# Altium schematic sheet Rs485.SchDoc
size A4
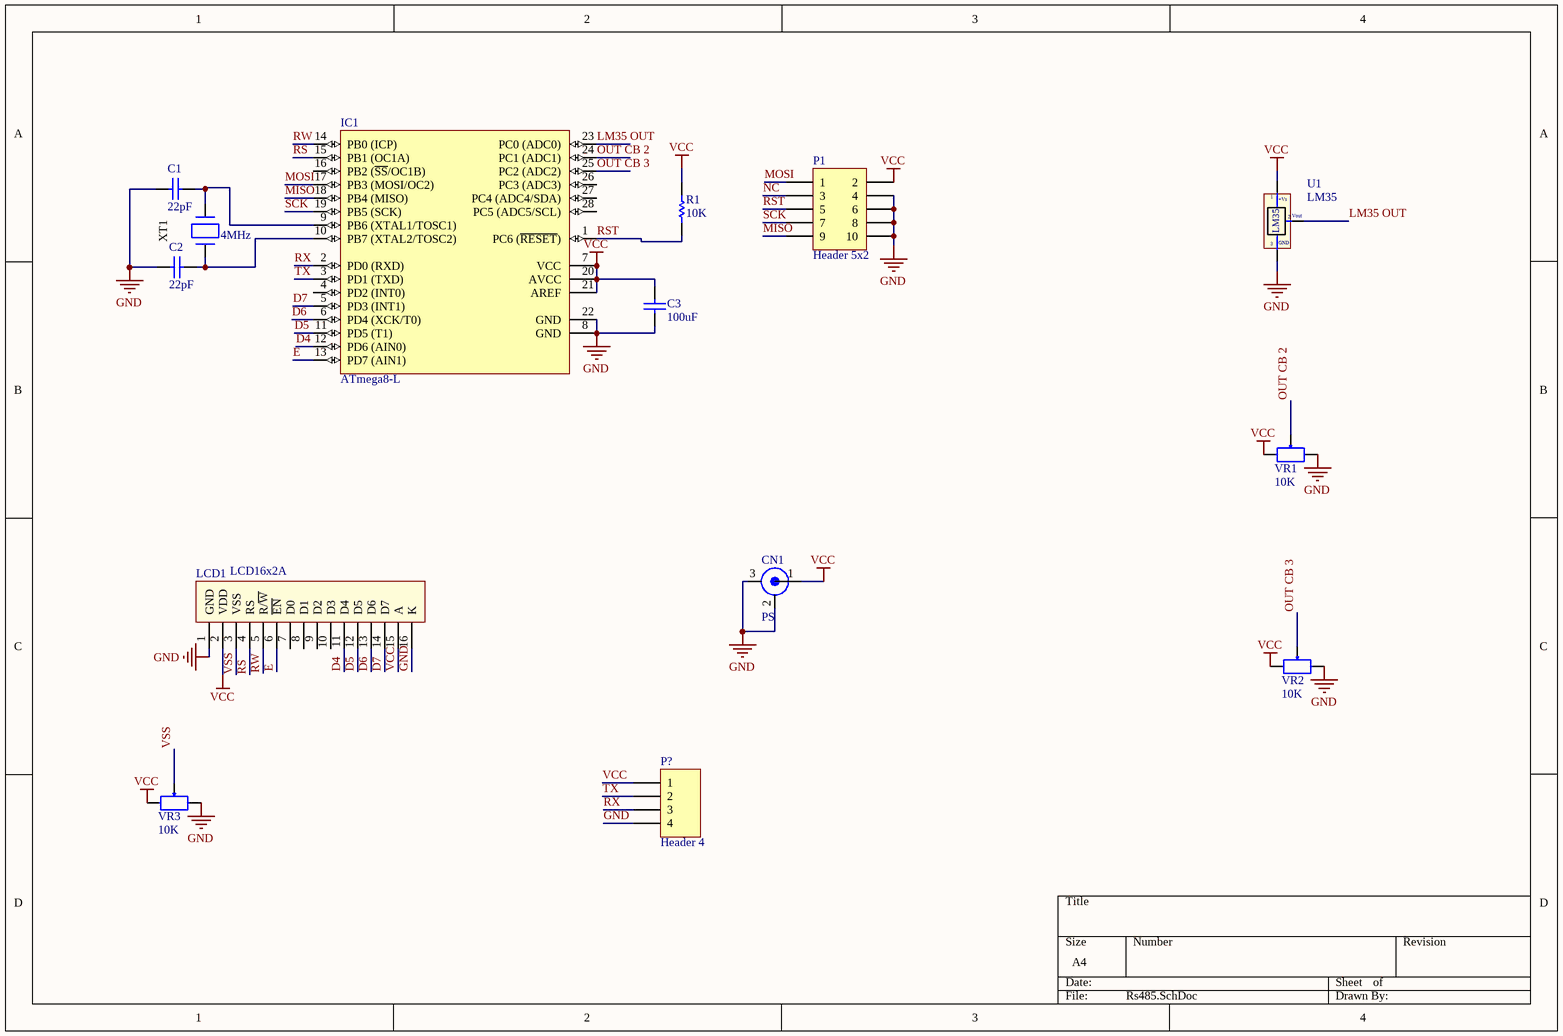
[diagram p0: Rs485.SchDoc]

## Parts
C1  value 22pF  [Cap Non-Pol 3mm]  (hidden comment: Cap Non-pol)
C2  value 22pF  [Cap Non-Pol 3mm]  (hidden comment: Cap Non-pol)
C3  value 100uF  [C-NP-0805]  (hidden comment: Cap Non-pol)
CN1  PS  [DC TERMINAL]
IC1  ATmega8-L  [DIP28/W0.3]
LCD1  LCD16x2A  [LCD16X2]
P1  Header 5x2  [Header 5x2]
P?  Header 4  [Header 4]
R1  value 10K  [R-0805]  (hidden comment: RESISTOR)
U1  LM35  [QTO-92]
VR1  10K  [VR]
VR2  10K  [VR]
VR3  10K  [VR]
XT1  value 4MHz  [Crystal.HC49/USxx]  (hidden comment: Crystal2)

## Nets
GND: C1.2 C2.2 C3.1 CN1.2(SHIELD) CN1.3(SHIELD) IC1.8(GND) IC1.22(GND) LCD1.1(GND) LCD1.16(K) P1.4 P1.6 P1.8 P1.10 P?.4 U1.3(-) VR1.3 VR2.3 VR3.3
VCC: C3.2 CN1.1(CENTER) IC1.7(VCC) IC1.20(AVCC) IC1.21(AREF) LCD1.2(VDD) LCD1.15(A) P1.2 P?.1 R1.2 U1.1(+Vs) VR1.1 VR2.1 VR3.1
D4: IC1.12(PD6_(AIN0)) LCD1.11(D4)
D5: IC1.11(PD5_(T1)) LCD1.12(D5)
D6: IC1.6(PD4_(XCK/T0)) LCD1.13(D6)
D7: IC1.5(PD3_(INT1)) LCD1.14(D7)
E: IC1.13(PD7_(AIN1)) LCD1.6(~{EN})
LM35 OUT: IC1.23(PC0_(ADC0)) U1.2(Vout)
MISO: IC1.18(PB4_(MISO)) P1.9
MOSI: IC1.17(PB3_(MOSI/OC2)) P1.1
NC: P1.3
OUT CB 2: IC1.24(PC1_(ADC1)) VR1.2
OUT CB 3: IC1.25(PC2_(ADC2)) VR2.2
RS: IC1.15(PB1_(OC1A)) LCD1.4(RS)
RST: IC1.1(PC6_(~{RESET})) P1.5 R1.1
RW: IC1.14(PB0_(ICP)) LCD1.5(R/~{W})
RX: IC1.2(PD0_(RXD)) P?.3
SCK: IC1.19(PB5_(SCK)) P1.7
TX: IC1.3(PD1_(TXD)) P?.2
VSS: LCD1.3(VSS) VR3.2
NetC1_1: C1.1 IC1.9(PB6_(XTAL1/TOSC1)) XT1.2
NetC2_1: C2.1 IC1.10(PB7_(XTAL2/TOSC2)) XT1.1

Not connected (* = marked no-connect by the designer): IC1 4(PD2_(INT0)) 16(PB2_(~{SS}/OC1B)) 26(PC3_(ADC3)) 27(PC4_(ADC4/SDA)) 28(PC5_(ADC5/SCL)); LCD1 7(D0) 8(D1) 9(D2) 10(D3)

## Notes on the sheet
- (in symbol LM35_2) GND

## Library data of the parts
C1-C3 = Cap Non-pol: Non-polarized Capacitor; Published: 8-Jun-2000; LatestRevisionDate: 17-Jul-2002; LatestRevisionNote: Re-released for DXP Platform.; PackageReference: RAD-0.3; Publisher: Altium Limited
CN1 = CON.DCjack: DC Power Jack, 2.5mm, KLD Series, PCB Mount; Vendor: Nhat Tao; ComponentLink1Description: Digikey Part link; ComponentLink2Description: Open DataSheet; ComponentLink2URL: H:\LIBRARY\LIBRARY.Datasheet\; Price: 1.500VND
IC1 = ATmega8-L: 8-Bit AVR Microcontroller with 8K Bytes of In-System Programmable Flash Memory; Value: ATmega8-L
LCD1 = LCD16x2: LCD dipslay 16 char, 2 line; Value: LCD16x2A
P1 = Header 5x2: Header, 10-Pin, 2-Row; LatestRevisionDate: 17-Jul-2002; LatestRevisionNote: Re-released for DXP Platform.; Publisher: Altium Limited
P? = Header 4: Header, 4-Pin; LatestRevisionDate: 17-Jul-2002; LatestRevisionNote: Re-released for DXP Platform.; Publisher: Altium Limited
U1 = LM35_2: Teminal; Value: LM35
VR1-VR3 = VR: Var Resistor; Value: VR 10K
XT1 = Crystal2: Quarz Crystal; Vendor: Digikey; Published: 13-April-2009; Publisher: Hoang Nguyen; ComponentLink1Description: Digikey Part Link; ComponentLink2Description: Open Datasheet; ComponentLink2URL: H:\LIBRARY\LIBRARY.Datasheet\; Price: 2000 VND
R1 = RESISTOR: Published: 8-Jun-2000; LatestRevisionDate: 17-Jul-2002; LatestRevisionNote: Re-released for DXP Platform.; PackageReference: AXIAL-0.3; Publisher: Altium Limited